# Altium schematic sheet USB_EMI_FLITER.SchDoc
size A3
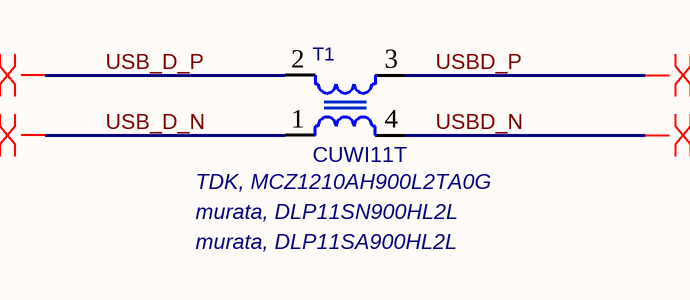
[diagram p0: USB_EMI_FLITER.SchDoc]

## Parts
T1  CUWI11T  [CUWI11T]

## Nets
USB_D_N: T1.1
USB_D_P: T1.2
USBD_N: T1.4
USBD_P: T1.3

## Layout directives
differential pair: USB_D_N, USB_D_P, USBD_N, USBD_P

## Notes on the sheet
- (near T1) murata, DLP11SA900HL2L
- (near T1) murata, DLP11SN900HL2L
- (near T1) TDK, MCZ1210AH900L2TA0G

## Library data of the parts
T1 = EMI_TRANS_CUWI11T: Choke, Common Mode, FER BEAD 90 OHM@100MHZ 250mA 20%; MANF: Chilisin; MANF_P#: CUWI11T-900Y; PARAM: 90 OHM@100MHZ, 0.4A; PRICE: 0.1$; VALUE: CUWI11T